# EAGLE schematic ecg-amplifier (EAGLE 7.2.0)
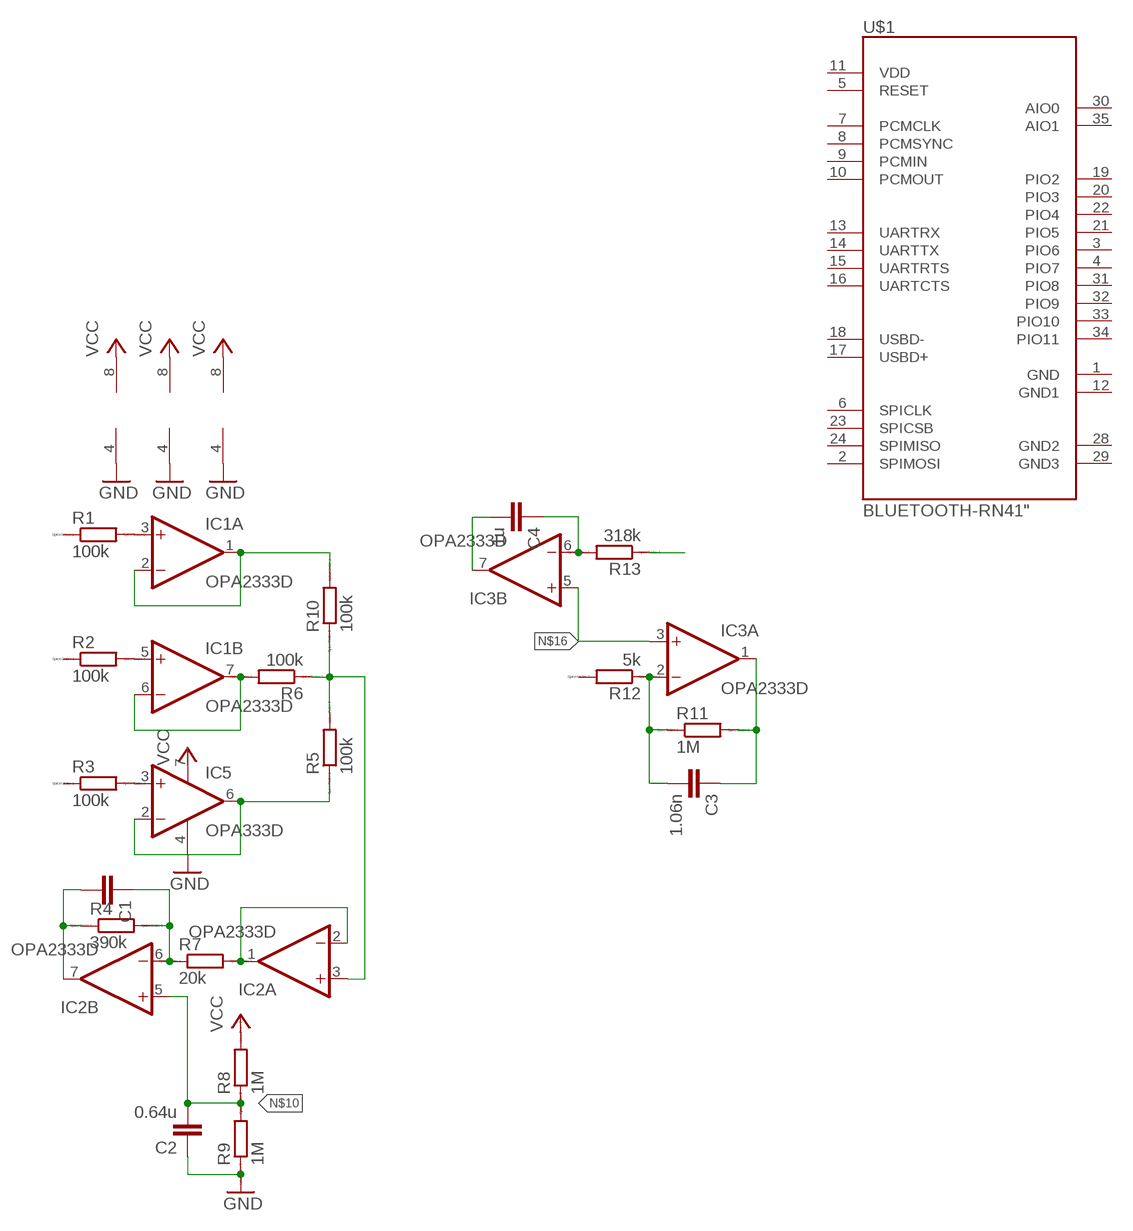
[diagram p0: schematic, sheet 1]

## Parts
C1  C-EUC0805  [C0805]
C2  0.64u  C-EUC0805  [C0805]
C3  1.06n  C-EUC0805  [C0805]
C4  1u  C-EUC0805  [C0805]
IC1  OPA2333D  [SO08]
IC2  OPA2333D  [SO08]
IC3  OPA2333D  [SO08]
IC5  OPA333D  [SO08]
R1  100k  R  [R0805]
R2  100k  R  [R0805]
R3  100k  R  [R0805]
R4  390k  R  [R0805]
R5  100k  R  [R0805]
R6  100k  R  [R0805]
R7  20k  R  [R0805]
R8  1M  R  [R0805]
R9  1M  R  [R0805]
R10  100k  R  [R0805]
R11  1M  R  [R0805]
R12  5k  R  [R0805]
R13  318k  R  [R0805]
U$1  BLUETOOTH-RN41"  [RN41]

## Nets
GND: C2.1 IC1.4(P:V-) IC2.4(P:V-) IC3.4(P:V-) IC5.4(V-) R9.1
N$1: IC1.3(A:+IN) R1.2
N$2: IC1.5(B:+IN) R2.2
N$3: IC5.3(+IN) R3.2
N$4: IC1.1(A:OUT) IC1.2(A:-IN) R10.2
N$5: IC1.6(B:-IN) IC1.7(B:OUT) R6.2
N$6: IC5.2(-IN) IC5.6(OUT) R5.1
N$7: C1.1 IC2.6(B:-IN) R4.2 R7.1
N$8: IC2.1(A:OUT) IC2.2(A:-IN) R7.2
N$9: C1.2 IC2.7(B:OUT) R4.1
N$10: C2.2 IC2.5(B:+IN) R8.1 R9.2
N$11: IC2.3(A:+IN) R5.2 R6.1 R10.1
N$12: C3.2 IC3.2(A:-IN) R11.1 R12.1
N$13: C3.1 IC3.1(A:OUT) R11.2
N$14: C4.1 IC3.6(B:-IN) R13.2
N$15: C4.2 IC3.7(B:OUT)
N$16: IC3.3(A:+IN) IC3.5(B:+IN)
N$18: R13.1
VCC: IC1.8(P:V+) IC2.8(P:V+) IC3.8(P:V+) IC5.7(V+) R8.2
Unconnected: R1.1 R2.1 R3.1 R12.2 U$1.1(GND) U$1.2(SPIMOSI) U$1.3(PIO6) U$1.4(PIO7) U$1.5(RESET) U$1.6(SPICLK) U$1.7(PCMCLK) U$1.8(PCMSYNC) U$1.9(PCMIN) U$1.10(PCMOUT) U$1.11(VDD) U$1.12(GND1) U$1.13(UARTRX) U$1.14(UARTTX) U$1.15(UARTRTS) U$1.16(UARTCTS) U$1.17(USBD+) U$1.18(USBD-) U$1.19(PIO2) U$1.20(PIO3) U$1.21(PIO5) U$1.22(PIO4) U$1.23(SPICSB) U$1.24(SPIMISO) U$1.28(GND2) U$1.29(GND3) U$1.30(AIO0) U$1.31(PIO8) U$1.32(PIO9) U$1.33(PIO10) U$1.34(PIO11) U$1.35(AIO1)

## Library data of the parts
C1-C4 = rcl:C-EU: CAPACITOR, European symbol
IC1-IC3 = linear:OPA2333: DUAL 1.8V, microPOWER CMOS OPERATIONAL AMPLIFIERS Zerø-Drift Series Source: Texas Instruments (Burr-Brown) .. U11 opa333 Operational Amp.pdf
IC5 = linear:OPA333: 1.8V, microPOWER CMOS OPERATIONAL AMPLIFIERS Zerø-Drift Series Source: Texas Instruments (Burr-Brown) .. U11 opa333 Operational Amp.pdf
R1-R13 = eagle-ltspice:R: RESISTOR, European symbol; SPICEMODEL: NONE; SPICEPREFIX: R
U$1 = SparkFun-RF:BLUETOOTH-RN41: Bluetooth SMD module